# Altium project AD9361_TEST_COUPON_EBB.PrjPcb
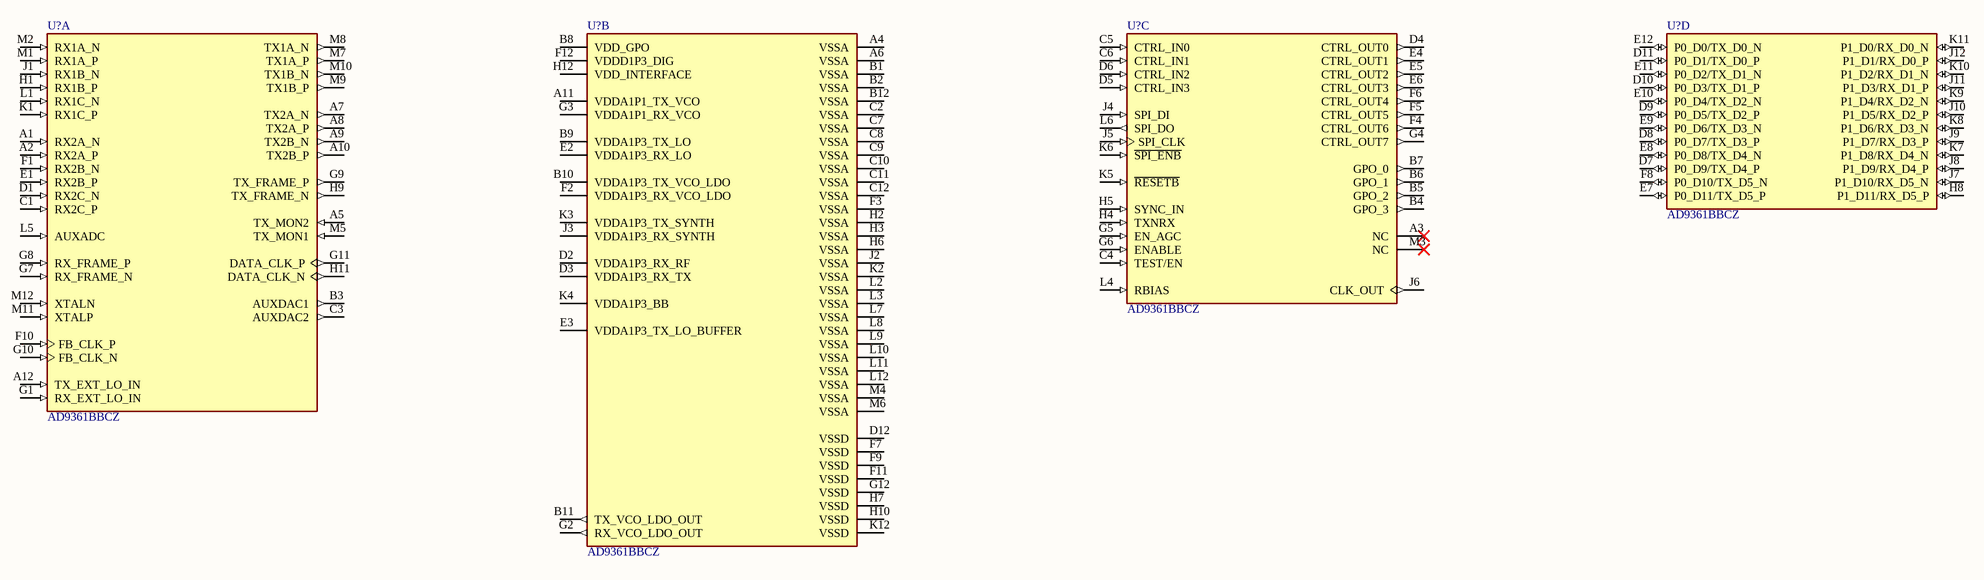
[diagram p0: AD9361.SchDoc]
1 sheet, 4 parts. Net scope: global (net labels, ports and power ports of the same name join across sheets).

## Sheet AD9361.SchDoc
size C; SheetNumber: 2; SheetTotal: 2

### Parts
(Parts that share a designator on the sheet are numbered #1, #2 ... from top to bottom, then left to right.)
U?#1  AD9361BBCZ  [BGA144C80P12X12_1000X1000X170]  (part A of 4)
U?#2  AD9361BBCZ  [BGA144C80P12X12_1000X1000X170]  (part B of 4)
U?#3  AD9361BBCZ  [BGA144C80P12X12_1000X1000X170]  (part C of 4)
U?#4  AD9361BBCZ  [BGA144C80P12X12_1000X1000X170]  (part D of 4)

### Nets

Not connected (* = marked no-connect by the designer): U?#1 A1(RX2A_N) A2(RX2A_P) A5(TX_MON2) A7(TX2A_N) A8(TX2A_P) A9(TX2B_N) A10(TX2B_P) A12(TX_EXT_LO_IN) B3(AUXDAC1) C1(RX2C_P) C3(AUXDAC2) D1(RX2C_N) E1(RX2B_P) F1(RX2B_N) F10(FB_CLK_P) G1(RX_EXT_LO_IN) G7(RX_FRAME_N) G8(RX_FRAME_P) G9(TX_FRAME_P) G10(FB_CLK_N) G11(DATA_CLK_P) H1(RX1B_P) H9(TX_FRAME_N) H11(DATA_CLK_N) J1(RX1B_N) K1(RX1C_P) L1(RX1C_N) L5(AUXADC) M1(RX1A_P) M2(RX1A_N) M5(TX_MON1) M7(TX1A_P) M8(TX1A_N) M9(TX1B_P) M10(TX1B_N) M11(XTALP) M12(XTALN); U?#2 A4(VSSA) A6(VSSA) A11(VDDA1P1_TX_VCO) B1(VSSA) B2(VSSA) B8(VDD_GPO) B9(VDDA1P3_TX_LO) B10(VDDA1P3_TX_VCO_LDO) B11(TX_VCO_LDO_OUT) B12(VSSA) C2(VSSA) C7(VSSA) C8(VSSA) C9(VSSA) C10(VSSA) C11(VSSA) C12(VSSA) D2(VDDA1P3_RX_RF) D3(VDDA1P3_RX_TX) D12(VSSD) E2(VDDA1P3_RX_LO) E3(VDDA1P3_TX_LO_BUFFER) F2(VDDA1P3_RX_VCO_LDO) F3(VSSA) F7(VSSD) F9(VSSD) F11(VSSD) F12(VDDD1P3_DIG) G2(RX_VCO_LDO_OUT) G3(VDDA1P1_RX_VCO) G12(VSSD) H2(VSSA) H3(VSSA) H6(VSSA) H7(VSSD) H10(VSSD) H12(VDD_INTERFACE) J2(VSSA) J3(VDDA1P3_RX_SYNTH) K2(VSSA) K3(VDDA1P3_TX_SYNTH) K4(VDDA1P3_BB) K12(VSSD) L2(VSSA) L3(VSSA) L7(VSSA) L8(VSSA) L9(VSSA) L10(VSSA) L11(VSSA) L12(VSSA) M4(VSSA) M6(VSSA); U?#3 A3(NC)* B4(GPO_3) B5(GPO_2) B6(GPO_1) B7(GPO_0) C4(TEST/EN) C5(CTRL_IN0) C6(CTRL_IN1) D4(CTRL_OUT0) D5(CTRL_IN3) D6(CTRL_IN2) E4(CTRL_OUT1) E5(CTRL_OUT2) E6(CTRL_OUT3) F4(CTRL_OUT6) F5(CTRL_OUT5) F6(CTRL_OUT4) G4(CTRL_OUT7) G5(EN_AGC) G6(ENABLE) H4(TXNRX) H5(SYNC_IN) J4(SPI_DI) J5(SPI_CLK) J6(CLK_OUT) K5(~{RESETB}) K6(~{SPI_ENB}) L4(RBIAS) L6(SPI_DO) M3(NC)*; U?#4 D7(P0_D9/TX_D4_P) D8(P0_D7/TX_D3_P) D9(P0_D5/TX_D2_P) D10(P0_D3/TX_D1_P) D11(P0_D1/TX_D0_P) E7(P0_D11/TX_D5_P) E8(P0_D8/TX_D4_N) E9(P0_D6/TX_D3_N) E10(P0_D4/TX_D2_N) E11(P0_D2/TX_D1_N) E12(P0_D0/TX_D0_N) F8(P0_D10/TX_D5_N) H8(P1_D11/RX_D5_P) J7(P1_D10/RX_D5_N) J8(P1_D9/RX_D4_P) J9(P1_D7/RX_D3_P) J10(P1_D5/RX_D2_P) J11(P1_D3/RX_D1_P) J12(P1_D1/RX_D0_P) K7(P1_D8/RX_D4_N) K8(P1_D6/RX_D3_N) K9(P1_D4/RX_D2_N) K10(P1_D2/RX_D1_N) K11(P1_D0/RX_D0_N)

### Library data of the parts
U?#1-U?#4 = CMP-00025-00008-1: RF and Baseband Circuit, PBGA144; Max Operating Temperature: 85°C; Pins: 144; Case/Package: LFBGA; Min Operating Temperature: -40°C; RoHS Compliant: Yes